# Altium schematic sheet 12-Electrodes.SchDoc: Electrodes
size A2; DocumentNumber: 12; SheetNumber: 12; SheetTotal: 15
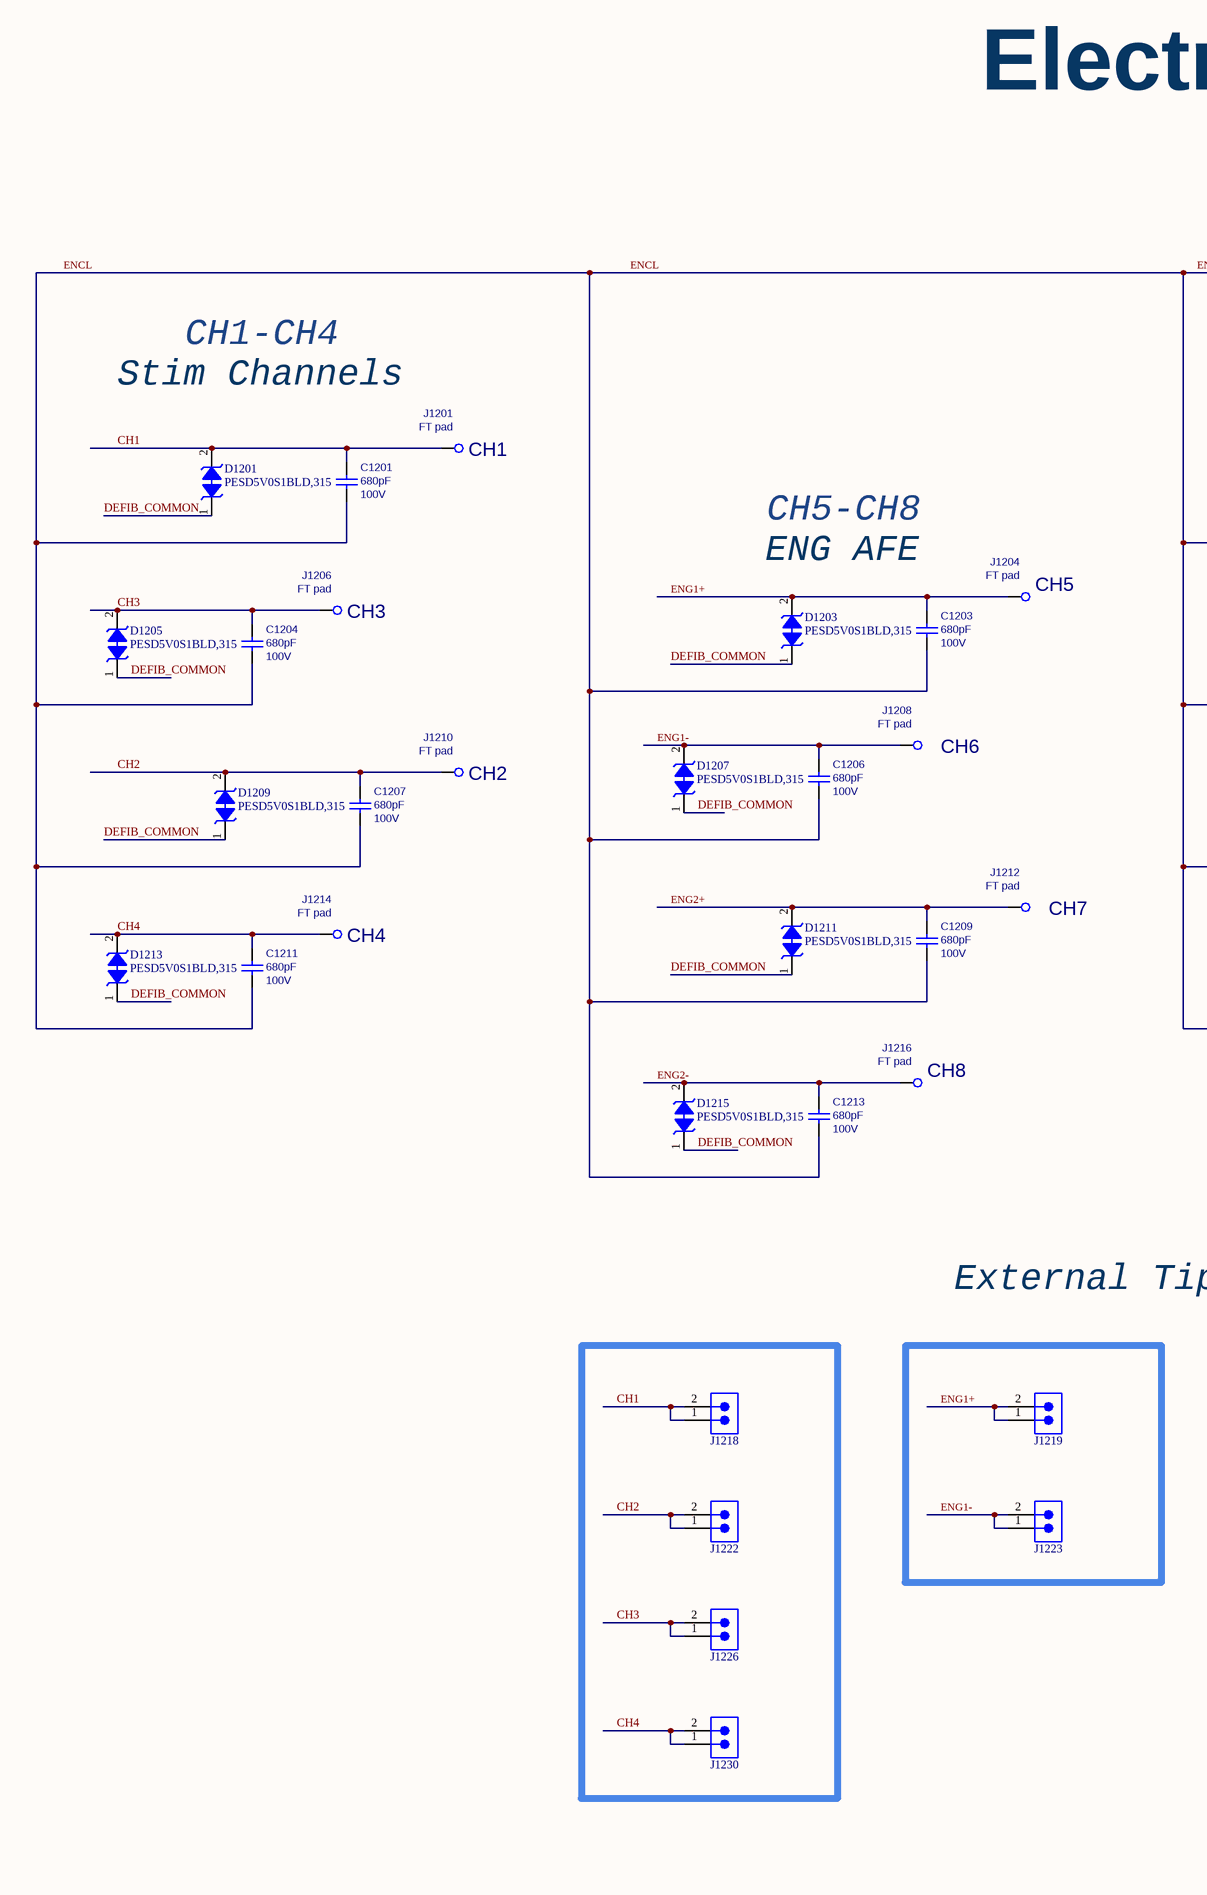
[diagram p0: 12-Electrodes.SchDoc, left]
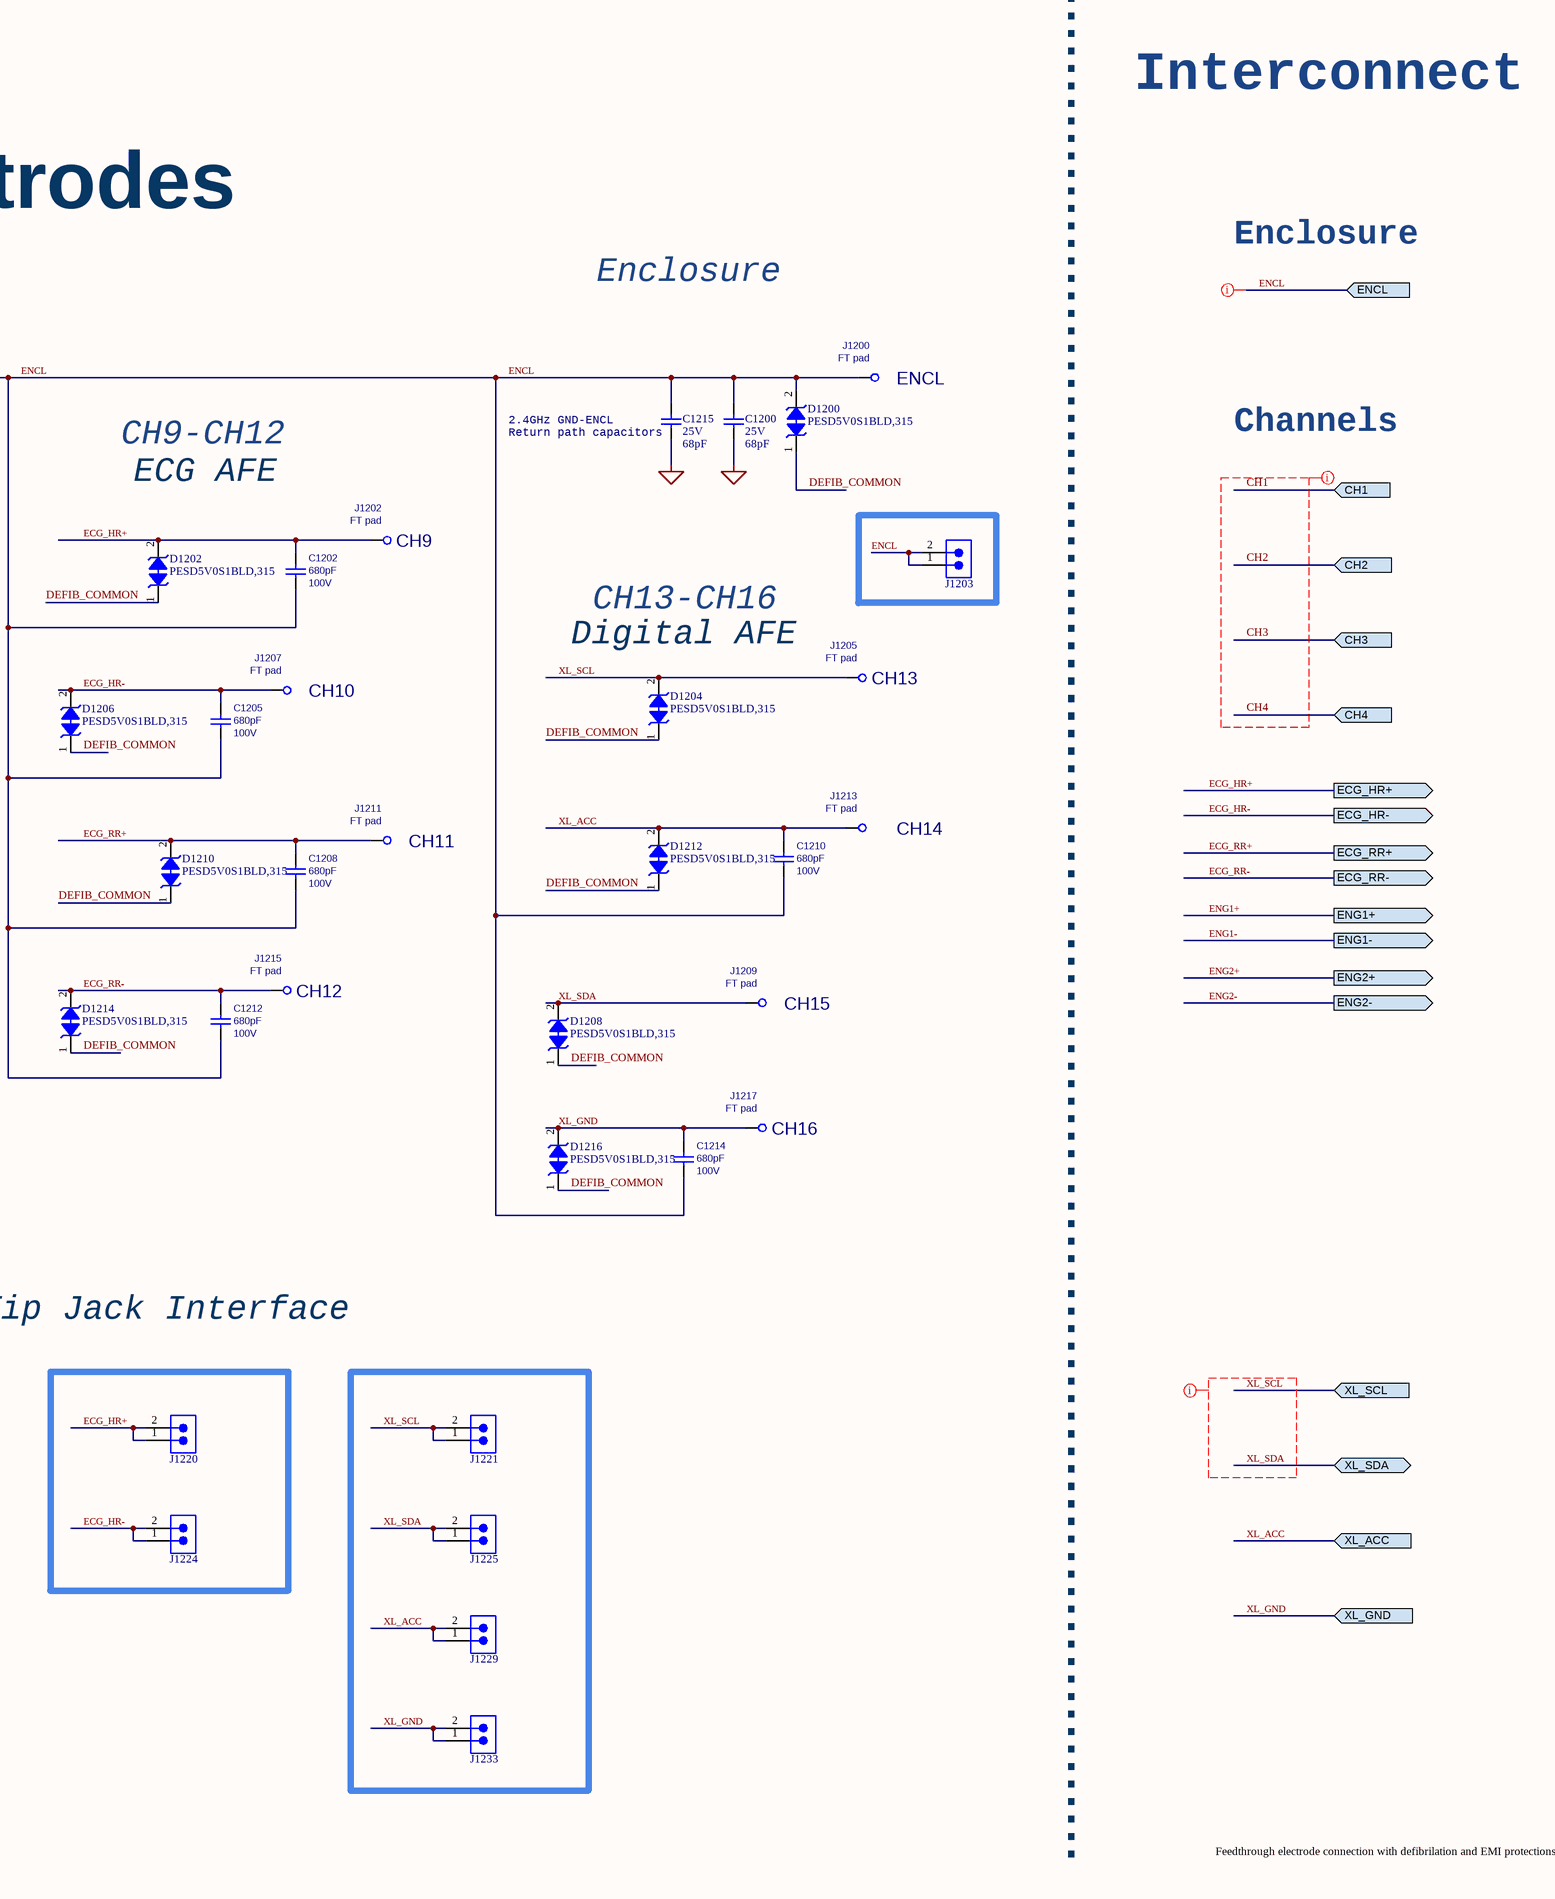
[diagram p1: 12-Electrodes.SchDoc, right]

## Parts
C1200  value 68pF  Voltage Rating: 25V  [C0201_C]  (hidden comment: GRT0335C1E680JA02D)
C1201  value 680pF  Rating: 100V  [CAP0402_REDUCED]  (hidden comment: C1005C0G2A681J050BE)
C1202  value 680pF  Rating: 100V  [CAP0402_REDUCED]  (hidden comment: C1005C0G2A681J050BE)
C1203  value 680pF  Rating: 100V  [CAP0402_REDUCED]  (hidden comment: C1005C0G2A681J050BE)
C1204  value 680pF  Rating: 100V  [CAP0402_REDUCED]  (hidden comment: C1005C0G2A681J050BE)
C1205  value 680pF  Rating: 100V  [CAP0402_REDUCED]  (hidden comment: C1005C0G2A681J050BE)
C1206  value 680pF  Rating: 100V  [CAP0402_REDUCED]  (hidden comment: C1005C0G2A681J050BE)
C1207  value 680pF  Rating: 100V  [CAP0402_REDUCED]  (hidden comment: C1005C0G2A681J050BE)
C1208  value 680pF  Rating: 100V  [CAP0402_REDUCED]  (hidden comment: C1005C0G2A681J050BE)
C1209  value 680pF  Rating: 100V  [CAP0402_REDUCED]  (hidden comment: C1005C0G2A681J050BE)
C1210  value 680pF  Rating: 100V  [CAP0402_REDUCED]  (hidden comment: C1005C0G2A681J050BE)
C1211  value 680pF  Rating: 100V  [CAP0402_REDUCED]  (hidden comment: C1005C0G2A681J050BE)
C1212  value 680pF  Rating: 100V  [CAP0402_REDUCED]  (hidden comment: C1005C0G2A681J050BE)
C1213  value 680pF  Rating: 100V  [CAP0402_REDUCED]  (hidden comment: C1005C0G2A681J050BE)
C1214  value 680pF  Rating: 100V  [CAP0402_REDUCED]  (hidden comment: C1005C0G2A681J050BE)
C1215  value 68pF  Voltage Rating: 25V  [C0201_C]  (hidden comment: GRT0335C1E680JA02D)
D1200  PESD5V0S1BLD,315  [PESD5V0S1BLD315]
D1201  PESD5V0S1BLD,315  [PESD5V0S1BLD315]
D1202  PESD5V0S1BLD,315  [PESD5V0S1BLD315]
D1203  PESD5V0S1BLD,315  [PESD5V0S1BLD315]
D1204  PESD5V0S1BLD,315  [PESD5V0S1BLD315]
D1205  PESD5V0S1BLD,315  [PESD5V0S1BLD315]
D1206  PESD5V0S1BLD,315  [PESD5V0S1BLD315]
D1207  PESD5V0S1BLD,315  [PESD5V0S1BLD315]
D1208  PESD5V0S1BLD,315  [PESD5V0S1BLD315]
D1209  PESD5V0S1BLD,315  [PESD5V0S1BLD315]
D1210  PESD5V0S1BLD,315  [PESD5V0S1BLD315]
D1211  PESD5V0S1BLD,315  [PESD5V0S1BLD315]
D1212  PESD5V0S1BLD,315  [PESD5V0S1BLD315]
D1213  PESD5V0S1BLD,315  [PESD5V0S1BLD315]
D1214  PESD5V0S1BLD,315  [PESD5V0S1BLD315]
D1215  PESD5V0S1BLD,315  [PESD5V0S1BLD315]
D1216  PESD5V0S1BLD,315  [PESD5V0S1BLD315]
J1200  value FT pad  [FEEDHOLE_20mil]  (hidden comment: THPAD_20m)  (no BOM)
J1201  value FT pad  [FEEDHOLE_20mil]  (hidden comment: THPAD_20m)  (no BOM)
J1202  value FT pad  [FEEDHOLE_20mil]  (hidden comment: THPAD_20m)  (no BOM)
J1203  TSW-102-26-G-S  [SMTC-TSW-102-26-XX-S]  (value not drawn)
J1204  value FT pad  [FEEDHOLE_20mil]  (hidden comment: THPAD_20m)  (no BOM)
J1205  value FT pad  [FEEDHOLE_20mil]  (hidden comment: THPAD_20m)  (no BOM)
J1206  value FT pad  [FEEDHOLE_20mil]  (hidden comment: THPAD_20m)  (no BOM)
J1207  value FT pad  [FEEDHOLE_20mil]  (hidden comment: THPAD_20m)  (no BOM)
J1208  value FT pad  [FEEDHOLE_20mil]  (hidden comment: THPAD_20m)  (no BOM)
J1209  value FT pad  [FEEDHOLE_20mil]  (hidden comment: THPAD_20m)  (no BOM)
J1210  value FT pad  [FEEDHOLE_20mil]  (hidden comment: THPAD_20m)  (no BOM)
J1211  value FT pad  [FEEDHOLE_20mil]  (hidden comment: THPAD_20m)  (no BOM)
J1212  value FT pad  [FEEDHOLE_20mil]  (hidden comment: THPAD_20m)  (no BOM)
J1213  value FT pad  [FEEDHOLE_20mil]  (hidden comment: THPAD_20m)  (no BOM)
J1214  value FT pad  [FEEDHOLE_20mil]  (hidden comment: THPAD_20m)  (no BOM)
J1215  value FT pad  [FEEDHOLE_20mil]  (hidden comment: THPAD_20m)  (no BOM)
J1216  value FT pad  [FEEDHOLE_20mil]  (hidden comment: THPAD_20m)  (no BOM)
J1217  value FT pad  [FEEDHOLE_20mil]  (hidden comment: THPAD_20m)  (no BOM)
J1218  TSW-102-26-G-S  [SMTC-TSW-102-26-XX-S]  (value not drawn)
J1219  TSW-102-26-G-S  [SMTC-TSW-102-26-XX-S]  (value not drawn)
J1220  TSW-102-26-G-S  [SMTC-TSW-102-26-XX-S]  (value not drawn)
J1221  TSW-102-26-G-S  [SMTC-TSW-102-26-XX-S]  (value not drawn)
J1222  TSW-102-26-G-S  [SMTC-TSW-102-26-XX-S]  (value not drawn)
J1223  TSW-102-26-G-S  [SMTC-TSW-102-26-XX-S]  (value not drawn)
J1224  TSW-102-26-G-S  [SMTC-TSW-102-26-XX-S]  (value not drawn)
J1225  TSW-102-26-G-S  [SMTC-TSW-102-26-XX-S]  (value not drawn)
J1226  TSW-102-26-G-S  [SMTC-TSW-102-26-XX-S]  (value not drawn)
J1229  TSW-102-26-G-S  [SMTC-TSW-102-26-XX-S]  (value not drawn)
J1230  TSW-102-26-G-S  [SMTC-TSW-102-26-XX-S]  (value not drawn)
J1233  TSW-102-26-G-S  [SMTC-TSW-102-26-XX-S]  (value not drawn)

## Ports
CH1 (in), CH2 (in), CH3 (in), CH4 (in), ECG_HR+ (out), ECG_HR- (out), ECG_RR+ (out), ECG_RR- (out), ENCL (in), ENG1+ (out), ENG1- (out), ENG2+ (out), ENG2- (out), XL_ACC (in), XL_GND (in), XL_SCL (in), XL_SDA (bidir)

## Nets
GND: C1200.1 C1215.1
CH1: C1201.2 D1201.2(K2) J1201.1 J1218.1 J1218.2 ; port CH1
CH2: C1207.2 D1209.2(K2) J1210.1 J1222.1 J1222.2 ; port CH2
CH3: C1204.2 D1205.2(K2) J1206.1 J1226.1 J1226.2 ; port CH3
CH4: C1211.2 D1213.2(K2) J1214.1 J1230.1 J1230.2 ; port CH4
DEFIB_COMMON: D1200.1(K1) D1201.1(K1) D1202.1(K1) D1203.1(K1) D1204.1(K1) D1205.1(K1) D1206.1(K1) D1207.1(K1) D1208.1(K1) D1209.1(K1) D1210.1(K1) D1211.1(K1) D1212.1(K1) D1213.1(K1) D1214.1(K1) D1215.1(K1) D1216.1(K1)
ECG_HR+: C1202.2 D1202.2(K2) J1202.1 J1220.1 J1220.2 ; port ECG_HR+
ECG_HR-: C1205.2 D1206.2(K2) J1207.1 J1224.1 J1224.2 ; port ECG_HR-
ECG_RR+: C1208.2 D1210.2(K2) J1211.1 ; port ECG_RR+
ECG_RR-: C1212.2 D1214.2(K2) J1215.1 ; port ECG_RR-
ENCL: C1200.2 C1201.1 C1202.1 C1203.1 C1204.1 C1205.1 C1206.1 C1207.1 C1208.1 C1209.1 C1210.1 C1211.1 C1212.1 C1213.1 C1214.1 C1215.2 D1200.2(K2) J1200.1 J1203.1 J1203.2 ; port ENCL
ENG1+: C1203.2 D1203.2(K2) J1204.1 J1219.1 J1219.2 ; port ENG1+
ENG1-: C1206.2 D1207.2(K2) J1208.1 J1223.1 J1223.2 ; port ENG1-
ENG2+: C1209.2 D1211.2(K2) J1212.1 ; port ENG2+
ENG2-: C1213.2 D1215.2(K2) J1216.1 ; port ENG2-
XL_ACC: C1210.2 D1212.2(K2) J1213.1 J1229.1 J1229.2 ; port XL_ACC
XL_GND: C1214.2 D1216.2(K2) J1217.1 J1233.1 J1233.2 ; port XL_GND
XL_SCL: D1204.2(K2) J1205.1 J1221.1 J1221.2 ; port XL_SCL
XL_SDA: D1208.2(K2) J1209.1 J1225.1 J1225.2 ; port XL_SDA

## Layout directives
net class ANALOG: CH1, CH2, CH3, CH4, ENCL
net class DIGITAL: XL_SCL, XL_SDA

## Notes on the sheet
- Interconnect
- Electrodes
- Enclosure
- 2.4GHz GND-ENCL
- (near J1200) ENCL
- Stim Channels
- CH1-CH4
- CH9-CH12
- ECG AFE
- (near C1215) Return path capacitors
- Channels
- (near J1201) CH1
- (near J1202) CH9
- CH5-CH8
- CH13-CH16
- ENG AFE
- (near J1204) CH5
- (near D1204) Digital AFE
- (near J1206) CH3
- (near J1207) CH10
- (near J1205) CH13
- (near J1210) CH2
- (near J1208) CH6
- (near J1211) CH11
- (near J1213) CH14
- (near J1212) CH7
- (near J1214) CH4
- (near J1215) CH12
- (near J1209) CH15
- (near J1216) CH8
- (near J1217) CH16
- External Tip Jack Interface
- Feedthrough electrode connection with defibrilation and EMI protections.
- Project:
- Schematic:
- Design by:
- Date:
- Ver:
- .
- Comments:
- Reviewed by:

## Library data of the parts
C1200 C1215 = GRT0335C1E680JA02D: Capacitor, 68pF, C0G, 25V, 5%, 0201, Implant-grade; Manufacturer: Murata; Medical Grade Manufacturer: TBD; Category: Capacitor; Manufacturer Part Number: GRT0335C1E680JA02D; Medical Grade Manufacturer Part Number: TBD; Size Code: Size Code; Supplier: TBD; Supplier Part Number: TBD; Height: 0.3mm; Width: 0.3mm; Length: 0.6mm; Tolerance: 5%; Dielectric: C0G; Supplier 1: Mouser; Supplier Part Number 1: 81-GRT0335C1E680JA2D; Supplier 2: Digikey; Supplier Part Number 2: 490-GRT0335C1E680JA02DTR-ND
C1201-C1214 = C1005C0G2A681J050BE: Capacitor, 680pF, C0G, 100V, 5%, 0402; Manufacturer: TDK; Medical Grade MFR: TBD; Review: 020823; Length (mm): 1.00 ±0.10; Medical Grade MFR PN: TBD; PCB Footprint: TBD; Thickness (mm): 0.50 ±0.10; Width (mm): 0.50 ±0.10; Category: Capacitor; Package Description: 0402; Supplier 1: Arrow Electronics; Supplier Part Number 1: C1005C0G2A681J050BE; Status: Approved; Manufacturer Part Number: C1005C0G2A681J050BE
D1200-D1216 = PESD5V0S1BLD,315: Diode ESD (Bi-directional); Manufacturer: Nexperia; Datasheet Link: https://assets.nexperia.com/documents/data-sheet/PESD5V0S1BLD.pdf; Height: 0.4mm; Mouser Part Number: 771-PESD5V0S1BLD315; Mouser Price/Stock: https://www.mouser.co.uk/ProductDetail/Nexperia/PESD5V0S1BLD315?qs=A1cBxND5mHLYeryYrbux2w%3D%3D; Arrow Part Number: PESD5V0S1BLD,315; Arrow Price/Stock: https://www.arrow.com/en/products/pesd5v0s1bld315/nexperia?region=nac; Manufacturer Part Number: PESD5V0S1BLD,315; Supplier 1: Future Electronics; Supplier Part Number 1: 8158301
J1200-J1202 J1204-J1217 = HOLE_20m: FT pad, Thru-hole, 20 mil hole; PCB Footprint: TBD; Category: FT pad; Length (mm): TBD; Manufacturer: N/A; Manufacturer PN: N/A; Medical Grade MFR: N/A; Medical Grade MFR PN: N/A; Rating: N/A; Thickness (mm): N/A; Width (mm): TBD; Package Description: FT pad; Status: *; Review: *
J1203 J1218-J1226 J1229 J1230 J1233 = TSW-102-26-G-S: Conn Unshrouded Header HDR 2 POS 2.54mm Solder ST Thru-Hole; Manufacturer: Samtec; Number of Contacts: 2; Gender: Male; Max Current Rating: 7.6A; Max Voltage Rating (AC): 550V; Category: Connectors; Supplier 1: Digikey; Supplier Part Number 1: SAM1077-02-ND; Stock: 3117; Manufacturer Part Number: TSW-102-26-G-S; Orientation: Vertical; ComponentLink3Description: Package Specification; PackageReference: TSW-102-26-XX-S; Mounting Technology: Through-hole; ComponentLink2Description: Datasheet; ComponentLink1URL: http://www.samtec.com; DatasheetVersion: F-214; ComponentLink1Description: Manufacturer URL; RoHS: True; ComponentLink2URL: http://www.samtec.com/documents/webfiles/pdf/TSW_TH.PDF; PartNumber: TSW-102-26-G-S; ComponentLink3URL: http://www.samtec.com/documents/webfiles/cpdf/TSW-XXX-XX-XXX-X-XX-XXX-MKT.pdf; Pitch: 2.54 mm; PackageDescription: .025[0.64] SQ. Post Terminal Strip Assembly; PackageVersion: DM, 8/1988; Temperature Range: -55 to 125 degC; Supplier: Newark; Supplier Part Number: 12P1301; Pricing: 1=0.51000, 10=0.47500, 100=0.33200, 500=0.28400, 1000=0.23700, 2500=0.21000, 5000=0.20400 (USD); Contact Plating: Gold; Contact Material: Bronze; Color: Black; Housing Material: Polyester; Contact Shape: Square; Contact Finish - Mating: GOLD; Insulation Color: Black; Insulation Material: PBT; Housing Color: Black; Min Operating Temperature: -55°C; Max Operating Temperature: 125°C; Number of Rows: 1; Packaging: Bulk; Termination: Solder; Number of Positions: 2; Connector Type: Header; Series: TSW; Contact Type: Male Pin; Fastening Type: Pull; Package Quantity: 1; Length: 5.08mm; Width: 2.54mm; Contact Mating Length: 0.23inch; Depth: 2.54mm; Radiation Hardening: No; RoHS Compliant: Yes; Flammability Rating: UL94 V-0; Lead Free: Lead Free; Reach SVHC Compliant: Yes; ComponentLink4URL: https://datasheet.ciiva.com/10281/htsw-th-10281416.pdf?src-supplier=Avnet; ComponentLink4Description: https://datasheet.ciiva.com/10281/htsw-th-10281416.pdf?src-supplier=Avnet; ComponentLink5URL: https://datasheet.ciiva.com/6887/tsw-xxx-xx-xxx-x-xx-xxx-mkt-6887237.pdf?src-supplier=Digi-Key; ComponentLink5Description: https://datasheet.ciiva.com/6887/tsw-xxx-xx-xxx-x-xx-xxx-mkt-6887237.pdf?src-supplier=Digi-Key